# Altium schematic sheet PCB_RS2321D.SchDoc
size A4; Organization: Altium Limited; Address1: L3, 12a Rodborough Rd; Address2: Frenchs Forest; Address3: NSW; Address4: Australia 2086; DocumentNumber: 3; SheetNumber: 3; SheetTotal: 7
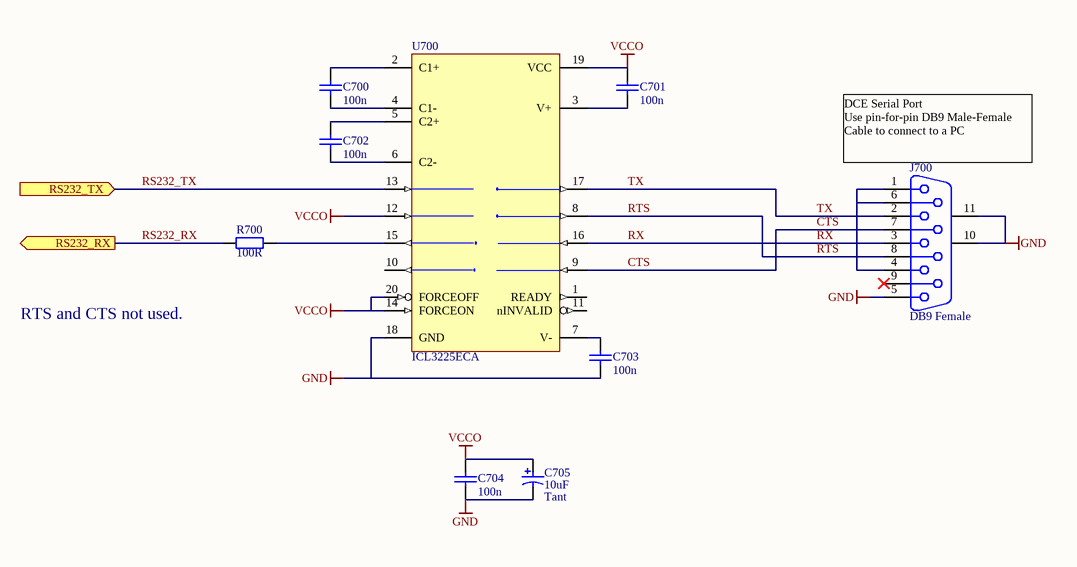
[diagram p0: PCB_RS2321D.SchDoc]

## Parts
C700  100n  [CC2012-0805]
C701  100n  [CC2012-0805]
C702  100n  [CC2012-0805]
C703  100n  [CC2012-0805]
C704  100n  [CC2012-0805]
C705  10uF  Capacitor Type: Tant  [MCCT-B]
J700  DB9 Female  [DSUB1.385-2H9]
R700  100R  [CC2012-0805]
U700  ICL3225ECA  [SSO-G20/P.65]

## Ports
RS232_RX (out), RS232_TX (in)

## Nets
GND: C703.2 C704.2 C705.2 J700.5 J700.10(MH1) J700.11(MH2) U700.18(GND)
VCCO: C701.1 C704.1 C705.1 U700.12(T2IN) U700.14(FORCEON) U700.19(VCC) U700.20(FORCEOFF)
CTS: J700.7 U700.9(R2IN)
RS232_RX: R700.2 ; port RS232_RX
RS232_TX: U700.13(T1IN) ; port RS232_TX
RTS: J700.8 U700.8(T2OUT)
RX: J700.3 U700.16(R1IN)
TX: J700.2 U700.17(T1OUT)
NetC700_1: C700.1 U700.2(C1+)
NetC700_2: C700.2 U700.4(C1-)
NetC701_2: C701.2 U700.3(V+)
NetC702_1: C702.1 U700.5(C2+)
NetC702_2: C702.2 U700.6(C2-)
NetC703_1: C703.1 U700.7(V-)
NetJ700_1: J700.1 J700.4 J700.6
NetR700_1: R700.1 U700.15(R1OUT)

Not connected (* = marked no-connect by the designer): J700 9*; U700 1(READY) 10(R2OUT) 11(nINVALID)

## Notes on the sheet
- (near J700) DCE Serial Port
  Use pin-for-pin DB9 Male-Female
  Cable to connect to a PC
- RTS and CTS not used.
- Title
- Size:
- Date:
- A4
- Number:
- Time:
- Revision:
- Sheet
- of
- File:

## Library data of the parts
C700-C704 = CAP: Capacitor; Fitted: True
C705 = CAP_POLAR: Polar Capacitor; Fitted: True
J700 = D Connector 9: Receptacle Assembly, 9 Position, Right Angle; Manufacturer: Generic Components; Package Information: Latest Revision: O; Positions: 9; Fitted: True; Published: 15-Jun-2001; Revision: July-2002: Re-released for DXP Platform.; Datasheet: (1-Sep-1999); Package Reference: 788750; Publisher: Altium Limited; Class I: Connector; Orientation: Right Angle; Gender: Receptacle
R700 = Res2: Resistor; Manufacturer: Generic Components; Class I: Passive; Published: 8-Jun-2000; Revision: July-2002: Re-released for DXP Platform.; Publisher: Altium Limited; Class II: Resistor
U700 = ICL3225ECA: 3.0V TO 5.5V, Low-Power, up to 1Mbps, True RS-232 Transceiver Using Four 0.1µF External Capacitor; Fitted: TRUE